# EAGLE design schematic (EAGLE 7.1.0)
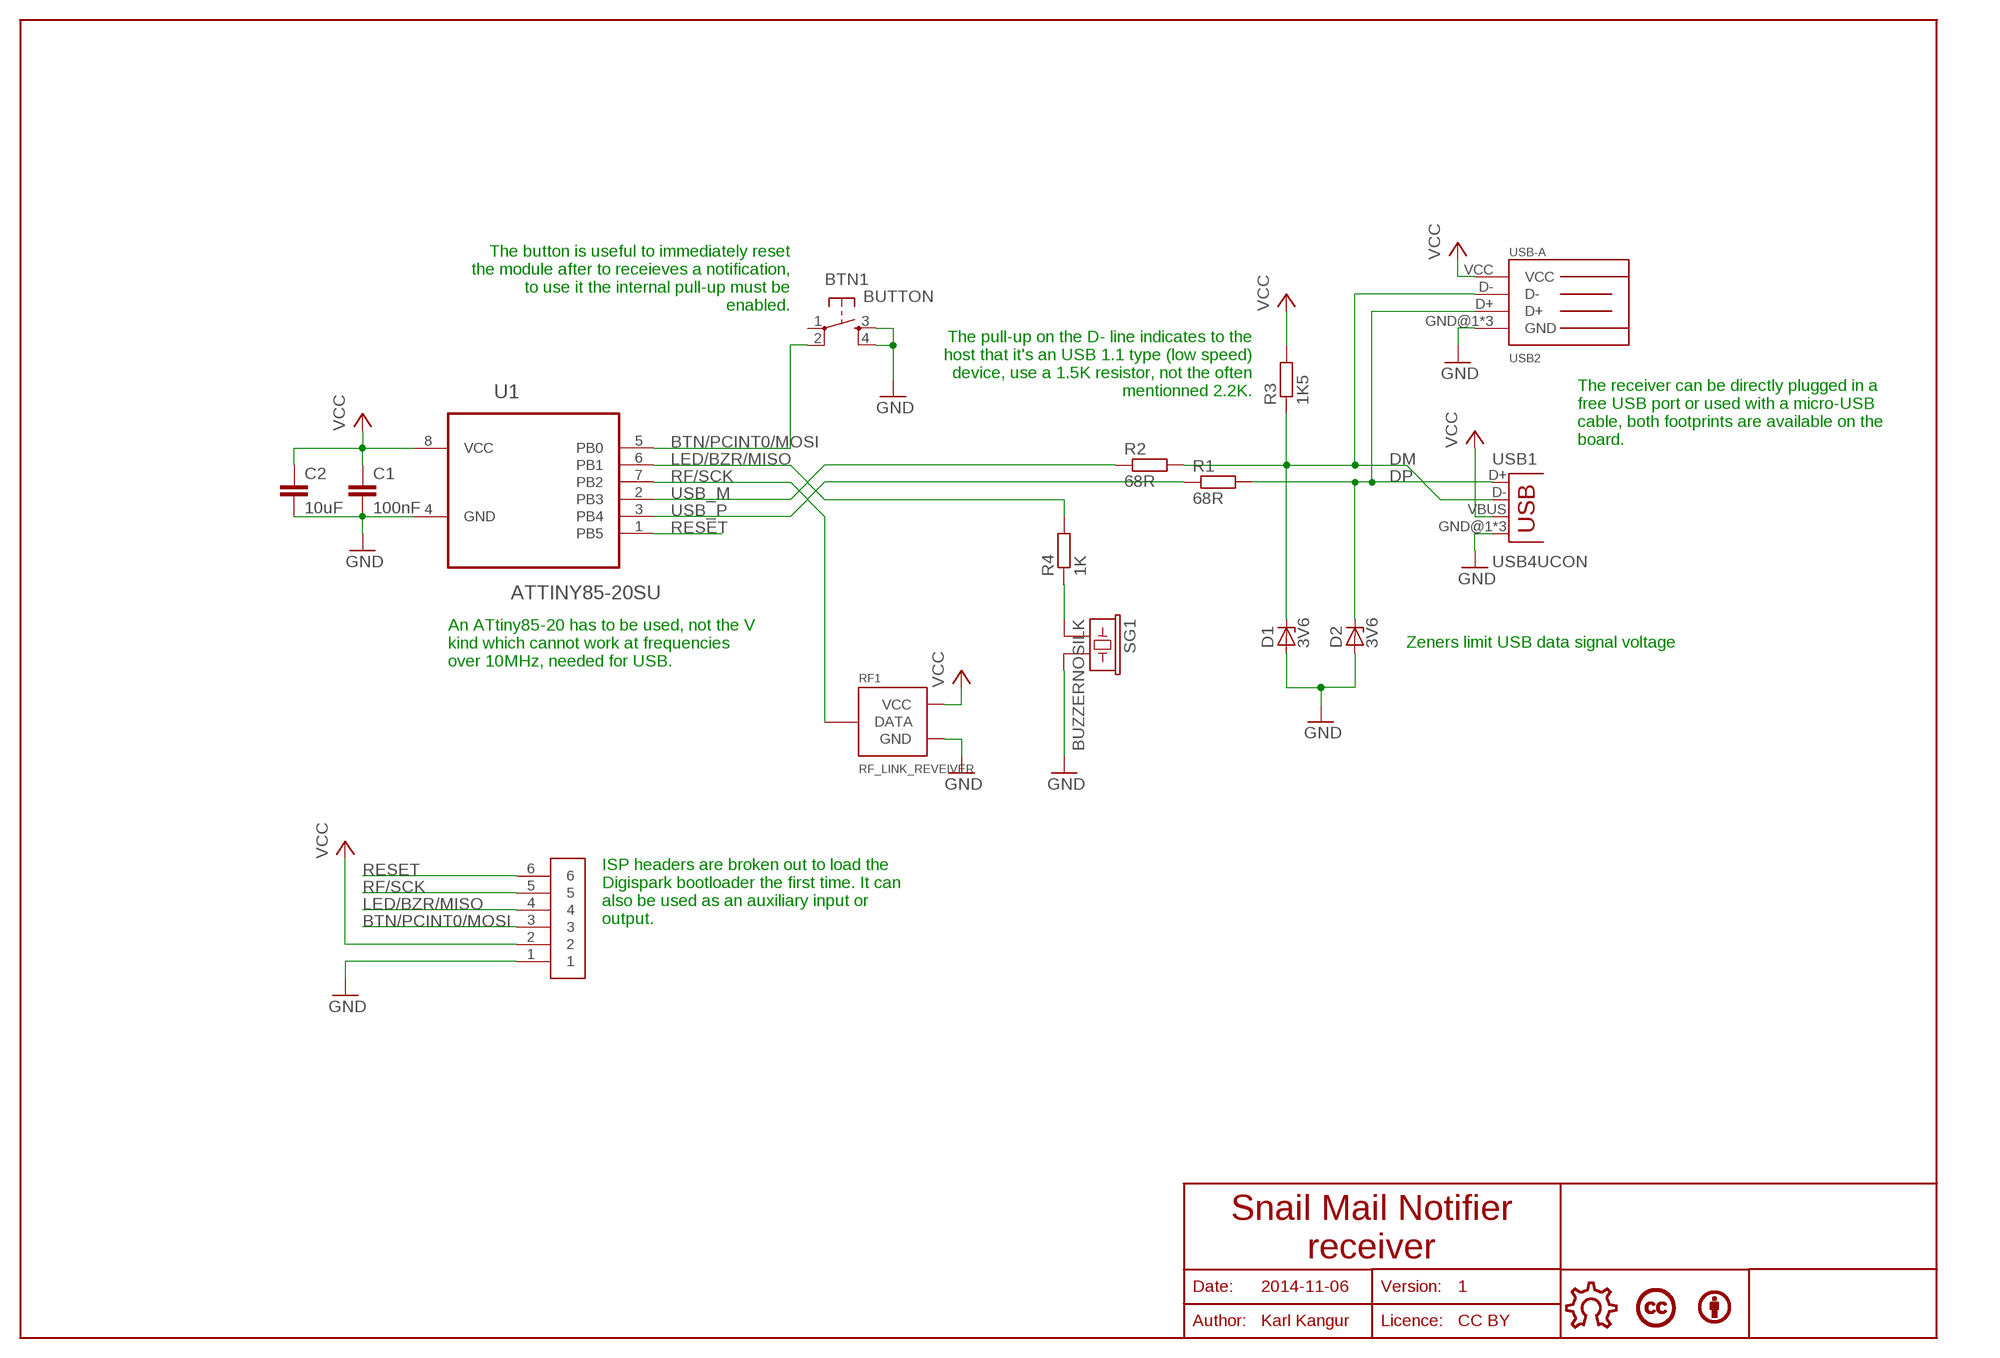
[diagram p0: schematic, sheet 1]

## Parts
BTN1  BUTTON  [BUTTON]
BY1  BYBOTTOM  [BY]
C1  100nF  C-EUC0805  [C0805]
C2  10uF  C-EUC0805  [C0805]
D1  3V6  ZENER-DIODESOD80C  [SOD80C]
D2  3V6  ZENER-DIODESOD80C  [SOD80C]
LICENCE1  LICENCECC-BOTTOM  [CREATIVE-COMMONS]
PIN1  PINS-6  [PINS-6]
R1  68R  R-EU_R0805  [R0805]
R2  68R  R-EU_R0805  [R0805]
R3  1K5  R-EU_R0805  [R0805]
R4  1K  R-EU_R0805  [R0805]
RF1  RF_LINK_REVEIVER  [RF_LINK_REVEIVER]
SG1  BUZZERNOSILK  [PS1240P02BT-NOSILK]
U1  ATTINY85-20SU  [SOIC127P798X216-8N]
U$5  OPEN-HARDWARE-LOGOBOTTOM-SMALL  [OPEN-HARDWARE-BOTTOM-SMALL]
USB1  USB4UCON  [USB-MICROB-4UCON]
USB2  USB-A  [USB-A]

## Nets
BTN/PCINT0/MOSI: BTN1.2 PIN1.3 U1.5(PB0)
DM: D1.C R2.2 R3.1 USB1.D- USB2.D-
DP: D2.C R1.2 USB1.D+ USB2.D+
GND: BTN1.3 BTN1.4 C1.2 C2.2 D1.A D2.A PIN1.1 RF1.GND SG1.P$2 U1.4(GND) USB1.GND@1(GND) USB1.GND@4(GND) USB1.GND@5(GND) USB2.GND@1(GND) USB2.GND@2(GND) USB2.GND@3(GND)
LED/BZR/MISO: PIN1.4 R4.2 U1.6(PB1)
N$1: R4.1 SG1.P$1
RESET: PIN1.6 U1.1(PB5)
RF/SCK: PIN1.5 RF1.DATA@1(DATA) RF1.DATA@2(DATA) U1.7(PB2)
USB_M: R2.1 U1.2(PB3)
USB_P: R1.1 U1.3(PB4)
VCC: C1.1 C2.1 PIN1.2 R3.2 RF1.VCC U1.8(VCC) USB1.VBUS USB2.VCC
Unconnected: BTN1.1

## Notes on the sheet
- The button is useful to immediately reset
  the module after to receieves a notification,
  to use it the internal pull-up must be
  enabled.
- The receiver can be directly plugged in a
  free USB port or used with a micro-USB
  cable, both footprints are available on the
  board.
- The pull-up on the D- line indicates to the
  host that it's an USB 1.1 type (low speed)
  device, use a 1.5K resistor, not the often
  mentionned 2.2K.
- An ATtiny85-20 has to be used, not the V
  kind which cannot work at frequencies
  over 10MHz, needed for USB.
- Zeners limit USB data signal voltage
- ISP headers are broken out to load the
  Digispark bootloader the first time. It can
  also be used as an auxiliary input or
  output.
- Snail Mail Notifier
  receiver
- Date: | 2014-11-06 | Version: | 1
- Author: | Karl Kangur | Licence: | CC BY

## Library data of the parts
BTN1 = karl_new:BUTTON
BY1 = robopoly:BY
C1 C2 = rcl:C-EU: CAPACITOR, European symbol
D1 D2 = diode:ZENER-DIODE: Z-Diode
LICENCE1 = robopoly:LICENCE
PIN1 = karl_new:PINS-6
R1-R4 = resistor:R-EU_: RESISTOR, European symbol; SPICEPREFIX: R
RF1 = robopoly:RF_LINK_REVEIVER
SG1 = robopoly:BUZZER: BUZZER Source: Buerklin
U1 = Atmel_By_element14_Batch_1:ATTINY85-20SU: 8-bit Microcontroller with In-System Programmable Flash; MPN: ATTINY85-20SU; OC_FARNELL: 1455164; OC_NEWARK: 58M3797; PACKAGE: SOIC-8; SUPPLIER: Atmel
U$5 = robopoly:OPEN-HARDWARE-LOGO
USB1 = robopoly:USB
USB2 = karl_new:USB-A

## Board
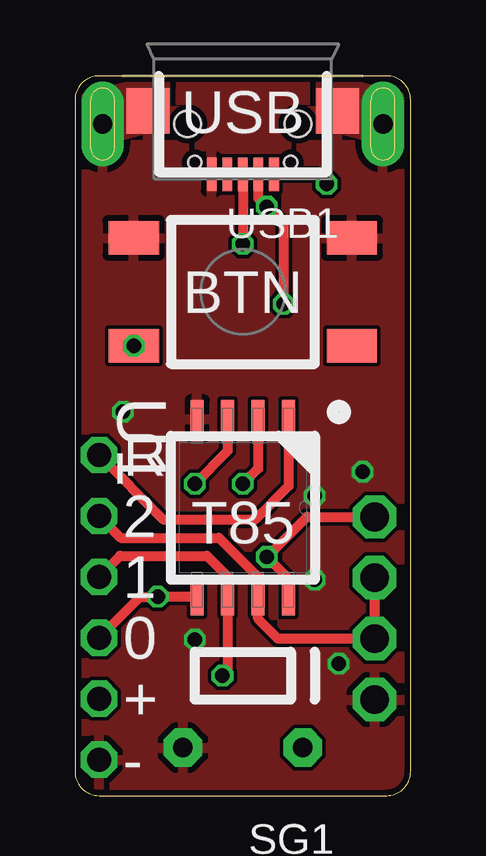
[diagram p1: board, top side]
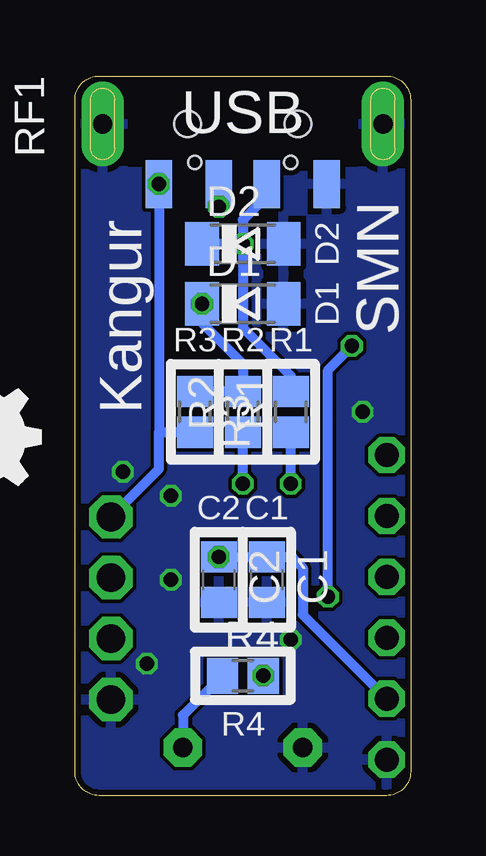
[diagram p2: board, bottom side, seen from below]

Size 14 x 30 mm. Coordinates in mm from the lower left corner, seen from the top.
Outline: 1,0 13,0 arc90 14,1 14,29 arc90 13,30 1,30 arc90 0,29 0,1 arc90 1,0
Copper layers (1*16): Top 0.035mm / dielectric 1.5mm / Bottom 0.035mm
Design rules "Seeedstudio_drc": minimum track width 6mil, minimum drill 12mil, track to track 6mil, track to pad 6mil, pad to pad 6mil, via to via 6mil, smd to smd 0mil, copper to edge 10mil, drill to drill 10mil, minimum pad ring 10mil, minimum via ring 6mil, stop-mask expansion 2mil, vias tented up to drill 100mil, thermal gap 10mil

### Footprints (pad centres in the part's own frame; a part is rotated, then mirrored left to right if it is on the bottom)
BUTTON = smd 1.4 x 2.1: 1 2.25,4.55; 2 2.25,-4.55; 3 -2.25,4.55; 4 -2.25,-4.55
C0805 = smd 1.3 x 1.5: 1 -0.95,0; 2 0.95,0
SOD80C = smd 1.4 x 1.8: A 1.7,0; C -1.7,0
PINS-6 = drill 1 octagon: 1 0,0; 2 0,2.54; 3 0,5.08; 4 0,7.62; 5 0,10.16; 6 0,12.7
R0805 = smd 1.3 x 1.5: 1 -0.85,0; 2 0.85,0
RF_LINK_REVEIVER = drill 1.2 octagon: DATA@1 23.46,1.5; DATA@2 20.92,1.5; GND 26,1.5; VCC 18.38,1.5
PS1240P02BT-NOSILK = drill 0.8 pad 1.6 octagon: P$1 -2.5,0; P$2 2.5,0
SOIC127P798X216-8N = smd 1.549 x 0.533: 1 -3.708,1.905; 2 -3.708,0.635; 3 -3.708,-0.635; 4 -3.708,-1.905; 5 3.708,-1.905; 6 3.708,-0.635; 7 3.708,0.635; 8 3.708,1.905
USB-MICROB-4UCON = smd 0.4 x 1.4: D+ 0,4.1; D- -0.65,4.1; GND@1 1.3,4.1; ID 0.65,4.1; VBUS -1.3,4.1 | smd 1.8 x 1.9: GND@4 -3.95,1.45; GND@5 3.95,1.45 | hole 0.55: -2,3.6; 2,3.6
USB-A = smd 1.1 x 2: D+ -1,2.5; D- 1,2.5; GND@1 -3.5,2.5; VCC 3.5,2.5 | drill 0.8 pad 1.778 long: GND@2 -5.85,0; GND@3 5.85,0 | hole 1.1: -2.3,0; 2.3,0

### Placement (x,y rotation side)
BTN1  7,21 270 top
BY1  30,15 0 bottom  (outside the outline)
C1  6,9 270 bottom
C2  8,9 270 bottom
D1  7,20.5 0 bottom
D2  7,23 0 bottom
LICENCE1  24,15 0 bottom  (outside the outline)
PIN1  1,1.5 0 top
R1  5,16 90 bottom
R2  7,16 90 bottom
R3  9,16 270 bottom
R4  7,5 0 bottom
RF1  14,30 270 bottom
SG1  7,2 180 top
U1  7,12 270 top
U$5  18,15 0 top  (outside the outline)
USB1  7,30 180 top
USB2  7,28 180 bottom

### Tracks (layer width: path | path; a pad name or v marks a point on that pad's centre or on a via)
BTN/PCINT0/MOSI  (via drill 0.6)
  Top 0.406: U1.5 v3.45,8.29 2.71,8.29 PIN1.3
  Bottom 0.406: v3.45,8.29 3.45,17.75 BTN1.2
  other vias: 2.45,18.75
DM  (via drill 0.6)
  Top 0.406: USB1.D- 7.65,24.9 v8,24.55 8.7,23.85 D1.C
  Bottom 0.406: 8.7,17.15 R3.1 R2.2 7,18 8.7,19.7 D1.C | USB2.D- v8,24.55
  other vias: 8.7,20.5
DP  (via drill 0.6)
  Top 0.406: USB1.D+ v7,23
  Bottom 0.406: v7,23 7,19.5 5,17.5 R1.2 | v7,23 D2.C | USB2.D+ 6,25 7,24 v7,23
GND  (via drill 0.6)
  other vias: 10,9 10,12.5 12,13.5 2,16 11,5.5 5,6.5
  pour Top: 0,30 14,30 14,0 0,0
  pour Bottom: 0,30 2,30 2,26 12,26 12,30 14,30 14,0 0,0
  pour Top (no thermals): 0,29 3.75,30 3.75,28 0,27
  pour Top (no thermals): 10.25,30 14,29 14,27 10.25,28
LED/BZR/MISO  (via drill 0.6)
  Top 0.406: PIN1.4 1.88,10 5.5,10 6.37,9.13 U1.6 6.37,5.21 R4.2
  other vias: 6.15,5
N$1
  Bottom 0.406: R4.1 9.5,3.35 SG1.P$1
RESET
  Top 0.406: U1.1 8.9,12.9 7.5,11.5 3.7,11.5 PIN1.6
RF/SCK
  Top 0.406: PIN1.5 1.91,10.75 6,10.75 7.63,9.12 U1.7 7.63,7.37 8.46,6.54 RF1.DATA@1 RF1.DATA@2
USB_M  (via drill 0.6)
  Top 0.406: U1.2 7.63,13.63 v7,13
  Bottom 0.406: v7,13 R2.1
USB_P  (via drill 0.6)
  Top 0.406: U1.3 6.37,14.37 v5,13
  Bottom 0.406: v5,13 R1.1
VCC  (via drill 0.6)
  Top 0.406: USB1.VBUS 10.1,25.9 USB2.VCC | U1.8 8.9,9.04 C2.1 9.67,11.62 RF1.VCC
  Bottom 0.406: USB2.VCC 10.5,15.15 | 10.5,15.15 R3.2 | RF1.VCC 10.5,13.62 10.5,15.15 | C2.1 C1.1 4.95,9.95 4.5,9.5 4.5,7.54 PIN1.2
  other vias: 10.5,25.5 8,9.95

### Text on the board
tPlace: USB | BTN | R | 2 | T85 | 1 | 0 | + | -
bPlace: USB | Kangur | D2 | SMN | D1 | R1 | R2 | R3 | C1 | C2 | R4
Document: Snail Mail Notifier receiver | Version: 1 | 2014-11-06 | Author: Karl Kangur | Licence: CC-BY | RESET | RF/SCK | LED/BZR/MISO | BTN/PCINT0/MOSI | VCC | GND